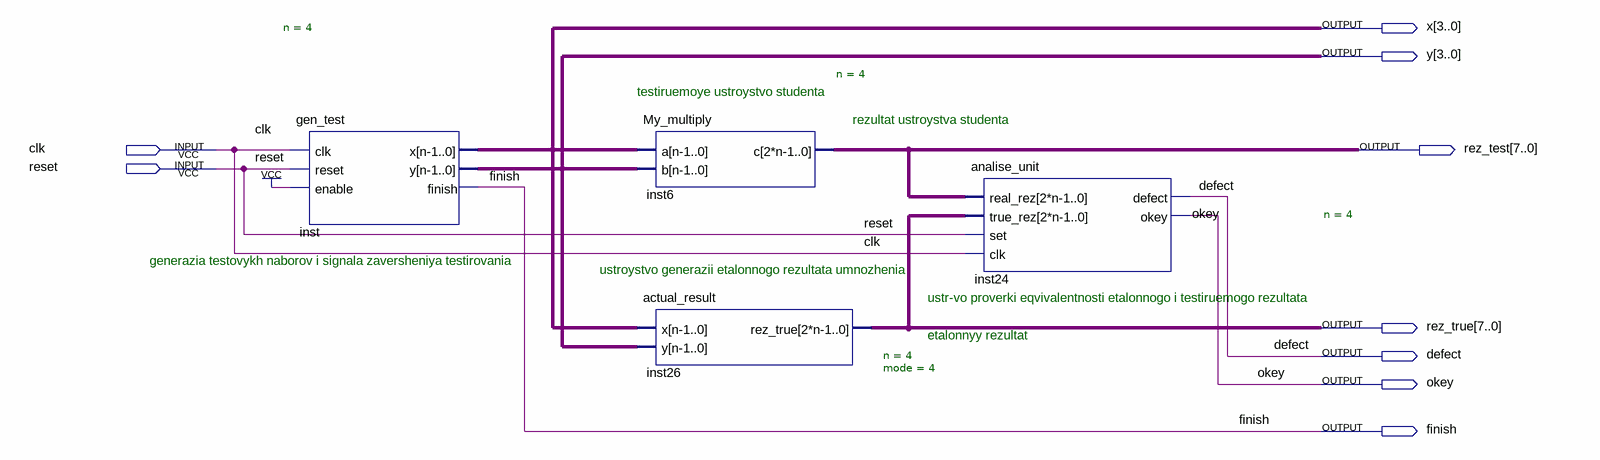
[diagram p0: schematic sheet]
// Quartus schematic test_alg.bdf as structural Verilog: 4 symbols, 9 pins
module test_alg (
  input  clk,
  input  reset,
  output [3:0] x,
  output [3:0] y,
  output [7:0] rez_test,
  output [7:0] rez_true,
  output defect,
  output okey,
  output finish
);

  gen_test #(.n(4)) inst (.clk(clk), .reset(reset), .enable(1'b1), .x(x), .y(y), .finish(finish));
  My_multiply #(.n(4)) inst6 (.a(x), .b(y), .c(rez_test));
  actual_result #(.n(4), .mode(4)) inst26 (.x(x), .y(y), .rez_true(rez_true));
  analise_unit #(.n(4)) inst24 (
    .real_rez(rez_test), .true_rez(rez_true), .set(reset), .clk(clk), .defect(defect), .okey(okey));

  // Notes on the sheet:
  //   testiruemoye ustroystvo studenta
  //   rezultat ustroystva studenta
  //   generazia testovykh naborov i signala zaversheniya testirovania
  //   ustroystvo generazii etalonnogo rezultata umnozhenia
  //   ustr-vo proverki eqvivalentnosti etalonnogo i testiruemogo rezultata
  //   etalonnyy rezultat
endmodule
